# EAGLE design lpc1227 (EAGLE 6.4)
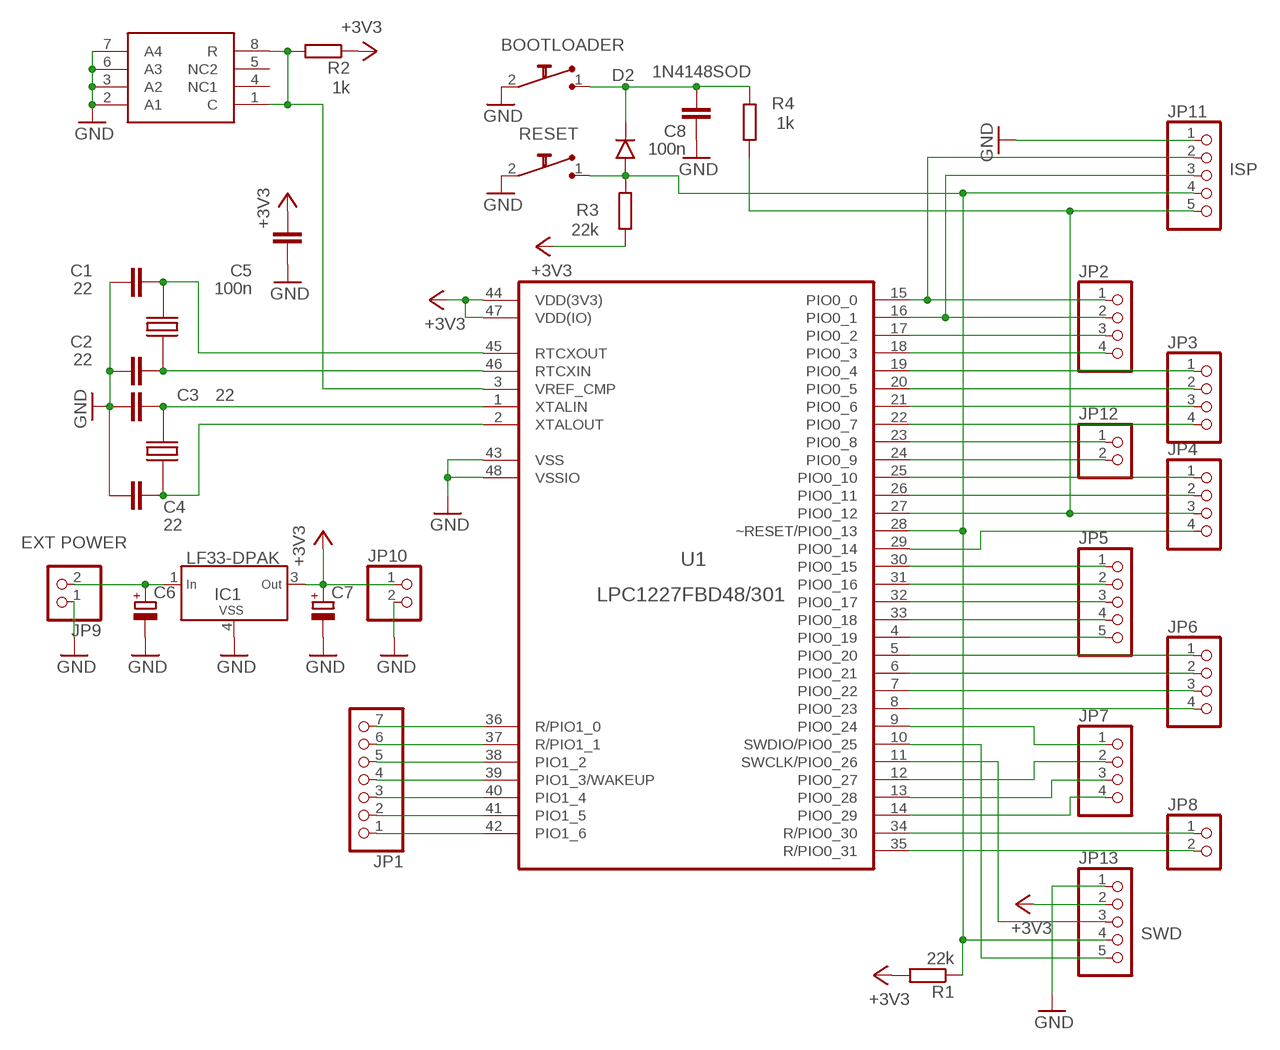
[diagram p0: schematic, sheet 1]

## Parts
C1  22  C_0806  [R0805]
C2  22  C_0806  [R0805]
C3  22  C_0806  [R0805]
C4  22  C_0806  [R0805]
C5  100n  C_0806  [R0805]
C6  CPOL-EUSMCA  [SMC_A]
C7  CPOL-EUSMCA  [SMC_A]
C8  100n  C_0806  [R0805]
D2  1N4148SOD  [SOD-80]
IC1  LF33-DPAK  [DPAK]
JP1  PINHD-1X07_2.54-S  [1X07-S]
JP2  PINHD-1X04_2.54-S  [1X04-S]
JP3  PINHD-1X04_2.54-S  [1X04-S]
JP4  PINHD-1X04_2.54-S  [1X04-S]
JP5  PINHD-1X05_2.54-S  [1X05-S]
JP6  PINHD-1X04_2.54-S  [1X04-S]
JP7  PINHD-1X04_2.54-S  [1X04-S]
JP8  PINHD-1X02_2.54-S  [1X02-S]
JP9  PINHD-1X02_2.54-S  [1X02-S]
JP10  PINHD-1X02_2.54-S  [1X02-S]
JP11  PINHD-1X05_2.54-S  [1X05-S]
JP12  PINHD-1X02_2.54-S  [1X02-S]
JP13  PINHD-1X05_2.54-S  [1X05-S]
K1  SWITCH_MINI  [SW_SMD_MINI]
K2  SWITCH_MINI  [SW_SMD_MINI]
R1  22k  R_0805  [R0805]
R2  1k  R_0805  [R0805]
R3  22k  R_0805  [R0805]
R4  1k  R_0805  [R0805]
U1  LPC1227FBD48/301  [QFP50P900X900X160-48N]
U$2  TL431_SO8  [SO8]
X1  12M  CRYST_TC26TC38  [TC38]
X2  32k  CRYST_TC26TC38  [TC38]

## Nets
+3V3: C5.2 C7.+ IC1.3(OUT) JP10.1 JP13.2 R1.2 R2.1 R3.1 U1.44(VDD(3V3)) U1.47(VDD(IO))
GND: C1.1 C2.1 C3.1 C4.1 C5.1 C6.- C7.- C8.1 IC1.4(VSS) JP9.1 JP10.2 JP11.1 JP13.1 K1.2 K2.2 U1.43(VSS) U1.48(VSSIO) U$2.2(A1) U$2.3(A2) U$2.6(A3) U$2.7(A4)
N$1: JP13.5 U1.10(SWDIO/PIO0_25)
N$2: JP13.3 U1.11(SWCLK/PIO0_26)
N$4: C3.2 U1.1(XTALIN) X2.P$2
N$5: C4.2 U1.2(XTALOUT) X2.P$1
N$6: C1.2 U1.45(RTCXOUT) X1.P$2
N$7: C2.2 U1.46(RTCXIN) X1.P$1
N$8: R2.2 U1.3(VREF_CMP) U$2.1(C) U$2.8(R)
N$9: JP4.4 U1.29(PIO0_14)
N$10: JP1.1 U1.42(PIO1_6)
N$11: JP1.2 U1.41(PIO1_5)
N$12: JP1.3 U1.40(PIO1_4)
N$13: JP1.4 U1.39(PIO1_3/WAKEUP)
N$14: JP1.5 U1.38(PIO1_2)
N$15: JP1.6 U1.37(R/PIO1_1)
N$16: JP1.7 U1.36(R/PIO1_0)
N$17: JP2.1 JP11.2 U1.15(PIO0_0)
N$18: JP2.2 JP11.3 U1.16(PIO0_1)
N$19: JP2.3 U1.17(PIO0_2)
N$20: JP2.4 U1.18(PIO0_3)
N$21: JP3.1 U1.19(PIO0_4)
N$22: JP3.2 U1.20(PIO0_5)
N$23: JP3.3 U1.21(PIO0_6)
N$24: JP3.4 U1.22(PIO0_7)
N$25: JP4.1 U1.25(PIO0_10)
N$26: JP4.2 U1.26(PIO0_11)
N$27: JP4.3 JP11.5 R4.1 U1.27(PIO0_12)
N$28: JP5.1 U1.30(PIO0_15)
N$29: JP5.2 U1.31(PIO0_16)
N$30: JP5.3 U1.32(PIO0_17)
N$31: JP5.4 U1.33(PIO0_18)
N$32: JP6.1 U1.5(PIO0_20)
N$33: JP6.2 U1.6(PIO0_21)
N$34: JP6.3 U1.7(PIO0_22)
N$35: JP6.4 U1.8(PIO0_23)
N$36: JP7.4 U1.14(PIO0_29)
N$37: JP7.3 U1.13(PIO0_28)
N$38: JP7.2 U1.12(PIO0_27)
N$39: JP7.1 U1.9(PIO0_24)
N$40: JP8.1 U1.34(R/PIO0_30)
N$41: JP8.2 U1.35(R/PIO0_31)
N$42: C6.+ IC1.1(IN) JP9.2
N$43: JP12.1 U1.23(PIO0_8)
N$44: JP12.2 U1.24(PIO0_9)
N$45: JP5.5 U1.4(PIO0_19)
N$46: D2.A JP11.4 JP13.4 K1.1 R1.1 R3.2 U1.28(~RESET/PIO0_13)
N$48: C8.2 D2.K K2.1 R4.2
Unconnected: U$2.4(NC1) U$2.5(NC2)

## Notes on the sheet
- BOOTLOADER
- RESET
- ISP
- EXT POWER
- SWD

## Library data of the parts
C1-C5 C8 = _moja:C
C6 C7 = _rcl:CPOL-EU: POLARIZED CAPACITOR, European symbol
D2 = _mcom5:1N4148
IC1 = _mcom5:LF33
JP1 = pinhead-2:PINHD-1X07: PIN HEADER
JP2-JP4 JP6 JP7 = pinhead-2:PINHD-1X04: PIN HEADER
JP5 JP11 JP13 = pinhead-2:PINHD-1X05: PIN HEADER
JP8-JP10 JP12 = pinhead-2:PINHD-1X02: PIN HEADER
K1 K2 = _moja:SWITCH_MINI
R1-R4 = _moja:R
U1 = _mcom5:LPC1227FBD48/301: MCU; MPN: LPC1227FBD48/301; OC_FARNELL: 1862476; OC_NEWARK: 26T2739; PACKAGE: QFP-48; SUPPLIER: NXP
U$2 = _moja:TL431_SO8
X1 X2 = _moja:CRYST_TC26

## Board
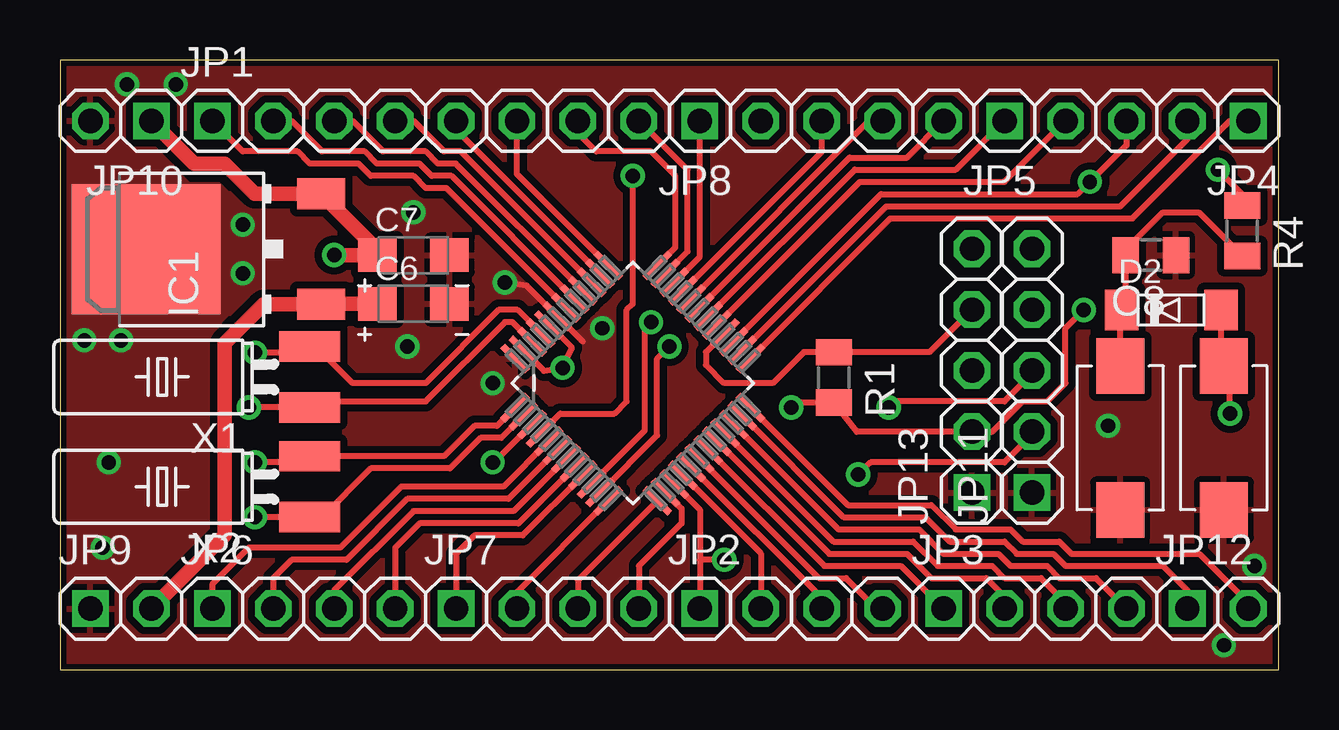
[diagram p1: board, top side]
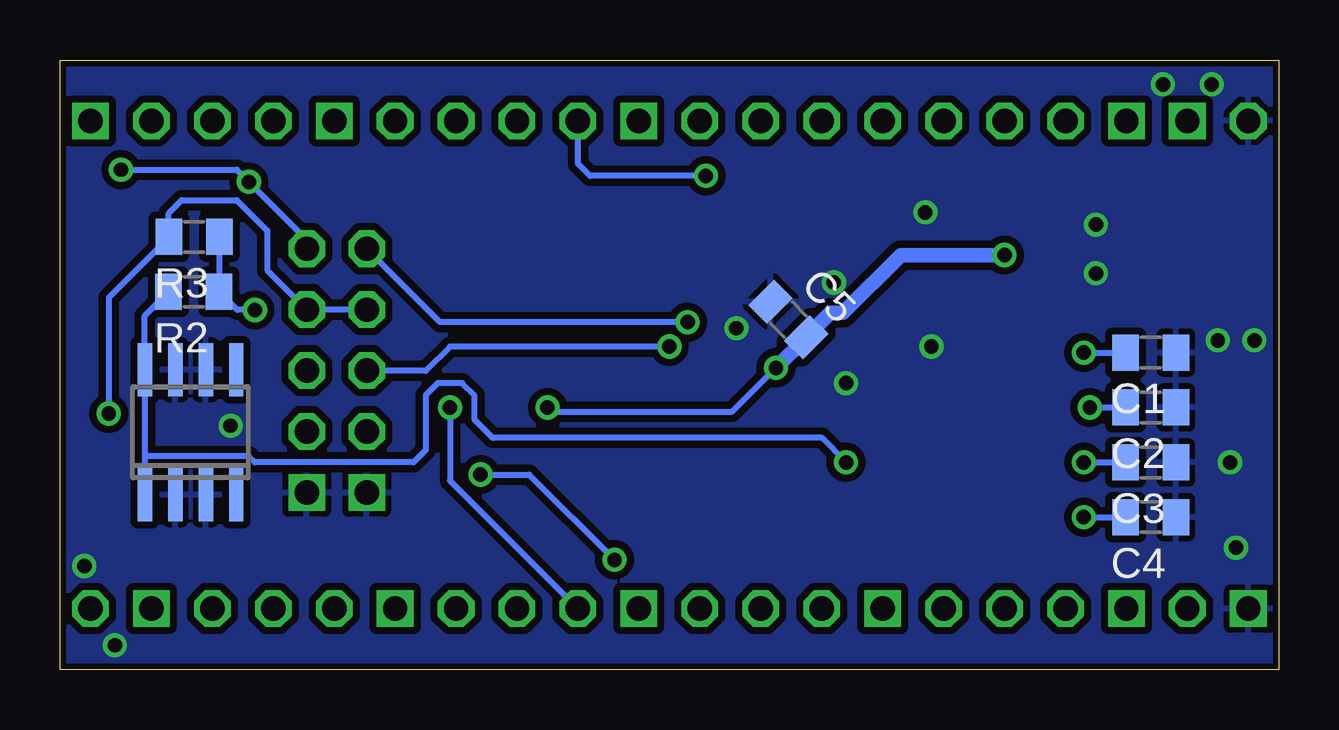
[diagram p2: board, bottom side, seen from below]

Size 50.8 x 25.4 mm. Coordinates in mm from the lower left corner, seen from the top.
Outline: 0,0 50.8,0 50.8,25.4 0,25.4 0,0
Copper layers (1*16): Top 0.035mm / dielectric 1.5mm / Bottom 0.035mm
Design rules "check12": minimum track width 8mil, minimum drill 23mil, track to track 12mil, track to pad 12mil, pad to pad 12mil, via to via 12mil, smd to smd 8mil, copper to edge 10mil, drill to drill 8mil, minimum pad ring 8mil, minimum via ring 8mil, stop-mask expansion 4mil, vias tented up to drill 0mil, thermal gap 10mil

### Footprints (pad centres in the part's own frame; a part is rotated, then mirrored left to right if it is on the bottom)
R0805 = smd 1.1 x 1.5: 1 -1.05,0; 2 1.05,0
SMC_A = smd 1.6 x 1.4: + -1.5,0; - 1.5,0
SOD-80 = smd 1.397 x 1.702: A 1.905,0; K -2.223,0
DPAK = smd 1.3 x 2: 1 -2.3,-4.793; 3 2.3,-4.793 | smd 5.4 x 6.2: 4 -0.01,2.5
1X07-S = drill 1.016 square: 1 -7.62,0 | drill 1.016 octagon: 2 -5.08,0; 3 -2.54,0; 4 0,0; 5 2.54,0; 6 5.08,0; 7 7.62,0
1X04-S = drill 1.016 square: 1 -3.81,0 | drill 1.016 octagon: 2 -1.27,0; 3 1.27,0; 4 3.81,0
1X05-S = drill 1.016 square: 1 -5.08,0 | drill 1.016 octagon: 2 -2.54,0; 3 0,0; 4 2.54,0; 5 5.08,0
1X02-S = drill 1.016 square: 1 -1.27,0 | drill 1.016 octagon: 2 1.27,0
SW_SMD_MINI = smd 2.3 x 2: 1 3,0; 2 -3,0
QFP50P900X900X160-48N = smd 1.473 x 0.279: 1 -4.191,2.743; 2 -4.191,2.261; 3 -4.191,1.753; 4 -4.191,1.245; 5 -4.191,0.762; 6 -4.191,0.254; 7 -4.191,-0.254; 8 -4.191,-0.762; 9 -4.191,-1.245; 10 -4.191,-1.753; 11 -4.191,-2.261; 12 -4.191,-2.743; 25 4.191,-2.743; 26 4.191,-2.261; 27 4.191,-1.753; 28 4.191,-1.245; 29 4.191,-0.762; 30 4.191,-0.254; 31 4.191,0.254; 32 4.191,0.762; 33 4.191,1.245; 34 4.191,1.753; 35 4.191,2.261; 36 4.191,2.743 | smd 0.279 x 1.473: 13 -2.743,-4.191; 14 -2.261,-4.191; 15 -1.753,-4.191; 16 -1.245,-4.191; 17 -0.762,-4.191; 18 -0.254,-4.191; 19 0.254,-4.191; 20 0.762,-4.191; 21 1.245,-4.191; 22 1.753,-4.191; 23 2.261,-4.191; 24 2.743,-4.191; 37 2.743,4.191; 38 2.261,4.191; 39 1.753,4.191; 40 1.245,4.191; 41 0.762,4.191; 42 0.254,4.191; 43 -0.254,4.191; 44 -0.762,4.191; 45 -1.245,4.191; 46 -1.753,4.191; 47 -2.261,4.191; 48 -2.743,4.191
SO8 = smd 0.6 x 2.2: 1 -1.905,-2.6; 2 -0.635,-2.6; 3 0.635,-2.6; 4 1.905,-2.6; 5 1.905,2.6; 6 0.635,2.6; 7 -0.635,2.6; 8 -1.905,2.6
TC38 = smd 1.27 x 2.54: P$1 -1.27,-4.572; P$2 1.27,-4.572

### Placement (x,y rotation side)
C1  5.33,13.21 180 bottom
C2  5.33,10.92 180 bottom
C3  5.33,8.64 180 bottom
C4  5.33,6.35 180 bottom
C5  20.44,14.59 315 bottom
C6  14.73,15.24 0 top
C7  14.73,17.27 0 top
C8  45.47,17.27 180 top
D2  46.48,14.99 0 top
IC1  6.1,17.53 90 top
JP1  13.97,22.86 0 top
JP2  30.48,2.54 0 top
JP3  40.64,2.54 0 top
JP4  45.72,22.86 180 top
JP5  34.29,22.86 180 top
JP6  10.16,2.54 0 top
JP7  20.32,2.54 0 top
JP8  25.4,22.86 180 top
JP9  2.54,2.54 0 top
JP10  2.54,22.86 180 top
JP11  40.51,12.46 90 top
JP12  48.26,2.54 0 top
JP13  38.01,12.46 90 top
K1  48.51,9.65 90 top
K2  44.2,9.65 90 top
R1  32.25,12.17 270 top
R2  45.22,15.74 180 bottom
R3  45.21,18.03 180 bottom
R4  49.28,18.29 270 top
U1  23.88,11.94 45 top
U$2  45.36,9.89 0 bottom
X1  5.84,12.19 90 top
X2  5.84,7.62 90 top

### Tracks (layer width: path | path; a pad name or v marks a point on that pad's centre or on a via)
+3V3  (via drill 0.6)
  Top 0.254: U1.47 20.17,12.45 v20.95,12.57 21.34,13.4 U1.44 | v30.48,10.92 30.68,11.12 R1.2 33.22,9.91 36.83,9.91 37.07,9.92 JP13.2 38.87,9.92 40.13,11.18 41.15,11.18 41.91,11.94 41.91,14.22 v42.67,14.99
  Top 0.61: v11.43,17.27 C7.+ 13.23,17.48 IC1.3 8.11,19.83 6.86,21.08 5.59,21.08 JP10.1
  Bottom 0.254: v30.48,10.92 30.3,10.75 22.78,10.75 v20.95,12.57 | v42.67,14.99 43.41,14.99 R2.1 44.16,15.75 R3.1
  Bottom 0.61: v11.43,17.27 15.75,17.27 18.16,14.86 18.68,14.86 C5.2 19.7,13.83 v20.95,12.57
GND  (via drill 0.6)
  Top 0.254: U1.43 21.74,13.72 21.79,13.66 19.46,16 v18.54,16.13
  other vias: 22.61,14.22 14.73,19.05 14.48,13.46 18.03,11.94 2.54,13.72 2.03,8.64 1.78,5.08 2.79,24.38 4.83,24.38 48.51,1.02 49.78,4.32 43.69,10.16 7.62,18.54 1.02,13.72 7.62,16.51
  pour Bottom: 0.25,0.25 50.55,0.25 50.55,25.15 0.25,25.15
  pour Top: 0.25,0.25 50.55,0.25 50.55,25.15 0.25,25.15
  pour Top (no thermals): 6.48,14.35 0.38,14.35 0.38,20.7 4.7,20.83 5.33,20.19 6.6,20.19 7.11,19.68 7.11,14.99
N$1  (via drill 0.6)
  Top 0.254: U1.10 24.38,9.97 24.38,14.22 v24.64,14.48
  Bottom 0.254: v24.64,14.48 34.96,14.48 JP13.5
N$2  (via drill 0.6)
  Top 0.254: U1.11 24.89,9.76 24.89,12.95 v25.4,13.46
  Bottom 0.254: v25.4,13.46 34.54,13.46 35.56,12.45 38,12.45 JP13.3
N$4  (via drill 0.6)
  Top 0.254: v8.13,8.64 10.16,8.64 X2.P$2 16,8.89 17.27,10.16 18.22,10.16 U1.1
  Bottom 0.254: v8.13,8.64 C3.2
N$5  (via drill 0.6)
  Top 0.254: 10.67,6.35 X2.P$1 | U1.2 18.39,9.65 17.53,9.65 16.26,8.38 12.95,8.38 10.92,6.35 X2.P$1 | X2.P$1 v8.13,6.35
  Bottom 0.254: v8.13,6.35 C4.2
N$6  (via drill 0.6)
  Top 0.254: U1.45 19.07,14.99 18.29,14.99 15.24,11.94 12.19,11.94 10.67,13.46 X1.P$2 10.16,13.21 v8.13,13.21
  Bottom 0.254: v8.13,13.21 C1.2
N$7  (via drill 0.6)
  Top 0.254: U1.46 18.86,14.48 18.54,14.48 15.24,11.18 10.92,11.18 10.67,10.92 X1.P$1 v7.87,10.92
  Bottom 0.254: v7.87,10.92 C2.2
N$8  (via drill 0.6)
  Top 0.254: U1.3 18.29,8.83 v18.03,8.64
  Bottom 0.254: v18.03,8.64 19.05,9.65 32.77,9.65 33.53,10.41 33.53,11.43 34.04,11.94 35.05,11.94 35.56,11.43 35.56,9.14 36.07,8.64 42.67,8.64 42.93,8.89 46.23,8.89 47.24,8.89 | 47.24,8.89 47.24,12.47 U$2.8 47.27,14.75 R2.2 | U$2.1 47.27,8.11 47.24,8.89
N$9
  Top 0.254: U1.29 33.34,20.32 39.37,20.32 JP4.4
N$10
  Top 0.254: U1.42 16.11,20.07 15.24,20.07 14.73,20.57 12.95,20.57 12.45,21.08 10.41,21.08 9.91,21.59 7.62,21.59 JP1.1
N$11
  Top 0.254: U1.41 16.32,20.57 15.49,20.57 14.99,21.08 13.21,21.08 12.7,21.59 10.92,21.59 9.65,22.86 JP1.2
N$12
  Top 0.254: U1.40 16.49,21.08 15.75,21.08 15.24,21.59 13.46,21.59 12.19,22.86 JP1.3
N$13
  Top 0.254: U1.39 16.7,21.59 16,21.59 14.73,22.86 JP1.4
N$14
  Top 0.254: U1.38 16.51,22.5 JP1.5
N$15
  Top 0.254: U1.37 19.05,20.64 JP1.6
N$16
  Top 0.254: U1.36 25.65,17.59 25.65,20.57 24.64,21.59 22.35,21.59 21.59,22.35 JP1.7
N$17  (via drill 0.6)
  Top 0.254: U1.15 26.67,6.67 26.67,4.57 | 26.67,4.57 JP2.1 | JP11.2 40.51,9.78 39.37,8.64 33.78,8.64 v33.27,8.13 | v27.69,4.57 26.67,4.57
  Bottom 0.254: v33.27,8.13 31.24,8.13 v27.69,4.57
N$18  (via drill 0.6)
  Top 0.254: U1.16 29.21,4.84 JP2.2 | JP11.3 40.51,12.32 39.37,11.18 34.8,11.18 v34.54,10.92
  Bottom 0.254: v34.54,10.92 34.54,7.87 JP2.2
N$19
  Top 0.254: U1.17 31.75,2.99 JP2.3
N$20
  Top 0.254: U1.18 31.64,3.81 32.77,3.81 34.04,2.54 JP2.4
N$21
  Top 0.254: U1.19 31.86,4.32 35.05,4.32 JP3.1
N$22
  Top 0.254: U1.20 32.07,4.83 35.31,4.83 36.32,3.81 38.61,3.81 39.37,3.05 JP3.2
N$23
  Top 0.254: U1.21 32.24,5.33 35.56,5.33 36.58,4.32 38.86,4.32 39.37,3.81 40.89,3.81 41.91,2.79 JP3.3
N$24
  Top 0.254: U1.22 32.45,5.84 35.81,5.84 36.83,4.83 39.12,4.83 39.62,4.32 41.15,4.32 41.66,3.81 43.18,3.81 JP3.4
N$25
  Top 0.254: U1.25 34.61,18.8 44.7,18.8 48.77,22.86 JP4.1
N$26
  Top 0.254: U1.26 34.44,19.3 44.2,19.3 46.99,22.1 JP4.2
N$27  (via drill 0.6)
  Top 0.254: U1.27 34.23,19.81 42.42,19.81 v42.93,20.32 44.45,21.84 JP4.3 | R4.1 49.28,19.81 v48.26,20.83
  Bottom 0.254: v48.26,20.83 43.43,20.83 v42.93,20.32 40.51,17.91 JP11.5
N$28
  Top 0.254: U1.30 33.12,20.83 37.34,20.83 JP5.1
N$29
  Top 0.254: U1.31 32.91,21.34 35.31,21.34 JP5.2
N$30
  Top 0.254: U1.32 33.72,22.86 JP5.3
N$31
  Top 0.254: U1.33 31.75,21.57 JP5.4
N$32
  Top 0.254: U1.5 18.48,7.62 14.22,7.62 11.68,5.08 7.87,5.08 6.35,3.56 JP6.1
N$33
  Top 0.254: U1.6 18.69,7.11 14.48,7.11 11.94,4.57 9.65,4.57 8.89,3.81 JP6.2
N$34
  Top 0.254: U1.7 18.9,6.6 14.73,6.6 11.43,3.3 JP6.3
N$35
  Top 0.254: U1.8 19.11,6.1 14.99,6.1 13.97,5.08 JP6.4
N$36
  Top 0.254: U1.14 25.91,6.71 25.91,6.1 24.13,4.32 JP7.4
N$37
  Top 0.254: U1.13 21.59,3.73 JP7.3
N$38
  Top 0.254: U1.12 19.05,3.23 JP7.2
N$39
  Top 0.254: U1.9 19.29,5.59 17.27,5.59 16.51,4.83 JP7.1
N$40
  Top 0.254: U1.34 26.67,17.21 JP8.1
N$41
  Top 0.254: U1.35 26.16,17.42 26.16,20.83 JP8.2
N$42
  Top 0.61: C6.+ 10.9,15.24 IC1.1 8.49,15.23 6.86,13.59 6.86,5.59 JP9.2
N$43
  Top 0.254: U1.23 32.66,6.35 36.07,6.35 37.08,5.33 39.37,5.33 39.88,4.83 41.4,4.83 41.91,4.32 45.97,4.32 46.99,3.3 JP12.1
N$44
  Top 0.254: U1.24 32.84,6.86 36.32,6.86 37.34,5.84 39.62,5.84 40.13,5.33 41.66,5.33 42.16,4.83 47.5,4.83 49.53,2.79 JP12.2
N$45  (via drill 0.6)
  Top 0.254: U1.4 20.85,10.67 23.11,10.67 23.62,11.18 23.62,14.99 23.88,15.24 v23.88,20.57
  Bottom 0.254: v23.88,20.57 28.7,20.57 29.21,21.08 JP5.5
N$46  (via drill 0.6)
  Top 0.254: U1.28 26.92,13.23 26.92,12.7 27.69,11.94 29.72,11.94 31,13.22 R1.1 36.24,13.22 JP13.4 | v48.77,10.67 48.77,12.4 K1.1 | 48.45,12.72 K1.1 | D2.A 48.39,12.78 K1.1
  Bottom 0.254: JP13.4 JP11.4 42.16,16.65 42.16,18.29 43.43,19.56 45.72,19.56 46.26,19.02 R3.2 46.26,18 48.77,15.49 v48.77,10.67
N$48
  Top 0.254: R4.2 47.46,19.05 45.97,19.05 44.42,17.49 C8.2 44.42,15.14 D2.K 44.2,14.92 K2.1